# Altium schematic sheet Comunicaciones.SchDoc
size A4
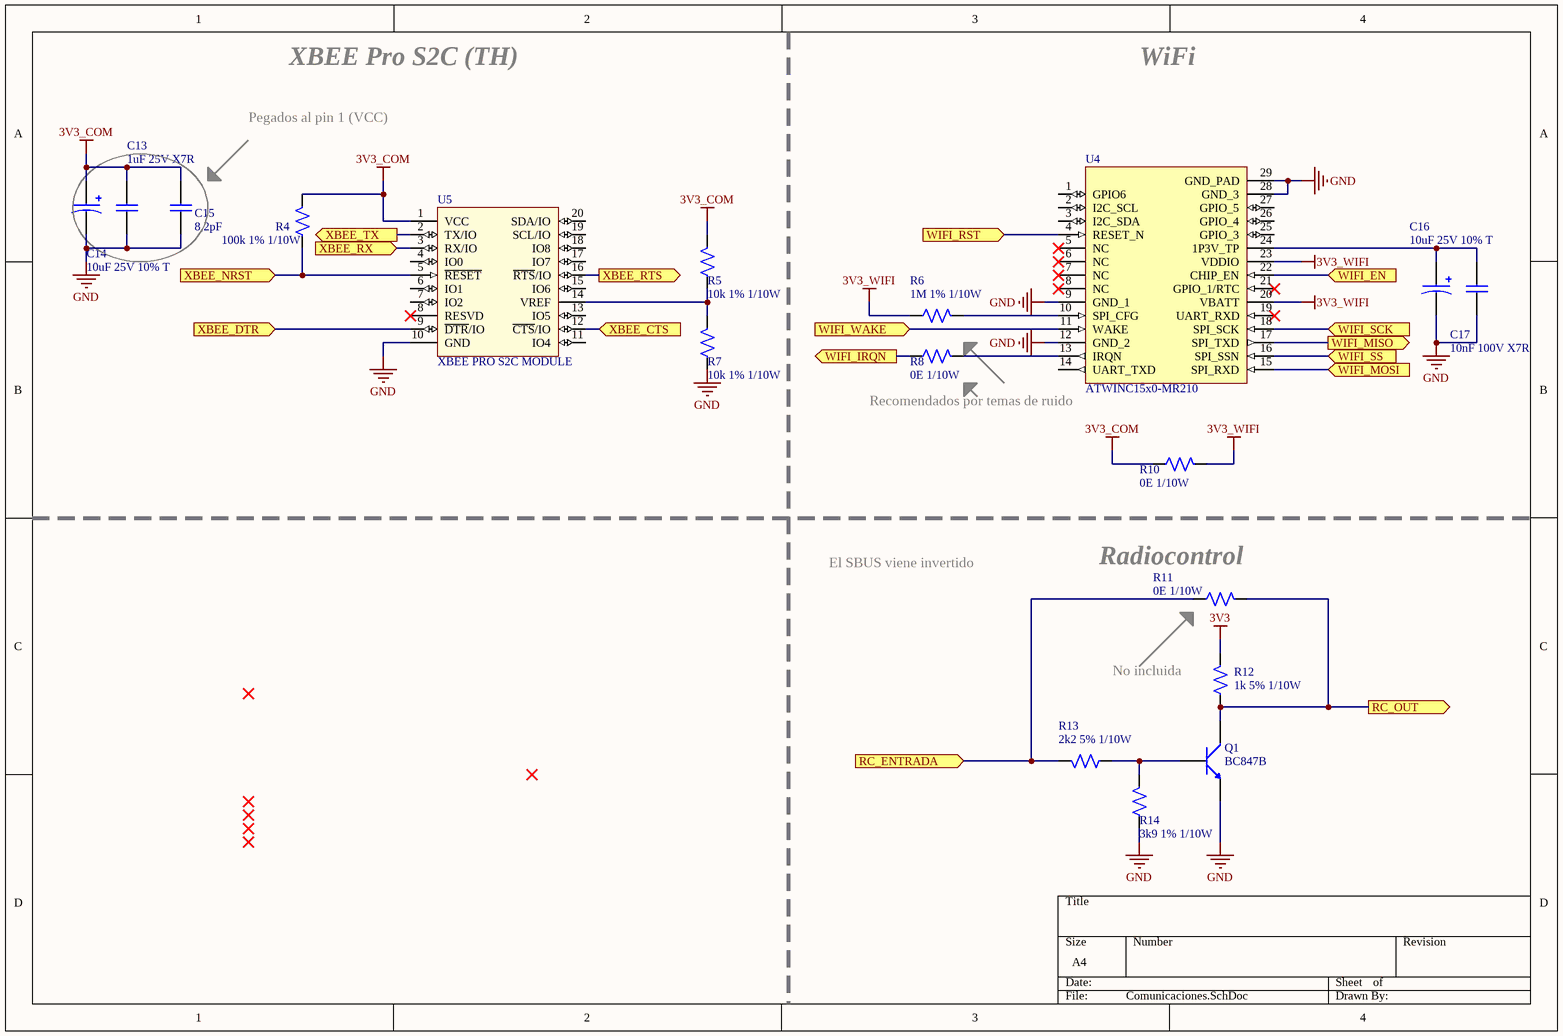
[diagram p0: Comunicaciones.SchDoc]

## Parts
C13  1uF 25V X7R  [C0603]
C14  10uF 25V 10% T  [AVX_C]
C15  Valor: 8,2pF  [C0603]  (hidden comment: 8,2pF 50V COG 5%)
C16  10uF 25V 10% T  [AVX_C]
C17  10nF 100V X7R  [C0603]
Q1  BC847B  [SOT23]
R4  100k 1% 1/10W  [R0603]
R5  10k 1% 1/10W  [R0603]
R6  1M 1% 1/10W  [R0603]
R7  10k 1% 1/10W  [R0603]
R8  0E 1/10W  [R0603]
R10  0E 1/10W  [R0805]
R11  0E 1/10W  [R0603]
R12  1k 5% 1/10W  [R0603]
R13  2k2 5% 1/10W  [R0603]
R14  3k9 1% 1/10W  [R0603]
U4  ATWINC15x0-MR210  [ATWINC15x0-MR210PB]
U5  XBEE PRO S2C MODULE  [XbeePRO]

## Ports
RC_ENTRADA (in), RC_OUT (out), WIFI_EN (in), WIFI_IRQN (out), WIFI_MISO (out), WIFI_MOSI (in), WIFI_RST (in), WIFI_SCK (in), WIFI_SS (in), WIFI_WAKE (in), XBEE_CTS (in), XBEE_DTR (in), XBEE_NRST (in), XBEE_RTS (out), XBEE_RX (in), XBEE_TX (out)

## Nets
3V3: R12.2
3V3_COM: C13.1 C14.1 C15.1 R4.2 R5.2 R10.1 U5.1(VCC)
3V3_WIFI: R6.1 R10.2 U4.20(VBATT) U4.23(VDDIO)
GND: C13.2 C14.2 C15.2 C16.2 C17.2 Q1.3(E) R7.1 R14.1 U4.9(GND_1) U4.12(GND_2) U4.28(GND_3) U4.29(GND_PAD) U5.10(GND)
RC_ENTRADA: R11.1 R13.2 ; port RC_ENTRADA
RC_OUT: Q1.2(C) R11.2 R12.1 ; port RC_OUT
WIFI_EN: U4.22(CHIP_EN) ; port WIFI_EN
WIFI_IRQN: R8.1 ; port WIFI_IRQN
WIFI_MISO: U4.17(SPI_TXD) ; port WIFI_MISO
WIFI_MOSI: U4.15(SPI_RXD) ; port WIFI_MOSI
WIFI_RST: U4.4(RESET_N) ; port WIFI_RST
WIFI_SCK: U4.18(SPI_SCK) ; port WIFI_SCK
WIFI_SS: U4.16(SPI_SSN) ; port WIFI_SS
WIFI_WAKE: U4.11(WAKE) ; port WIFI_WAKE
XBEE_CTS: U5.12(~{CTS}/IO) ; port XBEE_CTS
XBEE_DTR: U5.9(~{DTR}/IO) ; port XBEE_DTR
XBEE_NRST: R4.1 U5.5(~{RESET}) ; port XBEE_NRST
XBEE_RTS: U5.16(~{RTS}/IO) ; port XBEE_RTS
XBEE_RX: U5.3(RX/IO) ; port XBEE_RX
XBEE_TX: U5.2(TX/IO) ; port XBEE_TX
NetC16_1: C16.1 C17.1 U4.24(1P3V_TP)
NetQ1_1: Q1.1(B) R13.1 R14.2
NetR5_1: R5.1 R7.2 U5.14(VREF)
NetR6_2: R6.2 U4.10(SPI_CFG)
NetR8_2: R8.2 U4.13(IRQN)

Not connected (* = marked no-connect by the designer): U4 1(GPIO6) 2(I2C_SCL) 3(I2C_SDA) 5(NC)* 6(NC)* 7(NC)* 8(NC)* 14(UART_TXD) 19(UART_RXD)* 21(GPIO_1/RTC)* 25(GPIO_3) 26(GPIO_4) 27(GPIO_5); U5 4(IO0) 6(IO1) 7(IO2) 8(RESVD)* 11(IO4) 13(IO5) 15(IO6) 17(IO7) 18(IO8) 19(SCL/IO) 20(SDA/IO)

## Notes on the sheet
- XBEE Pro S2C (TH)
- WiFi
- Pegados al pin 1 (VCC)
- Recomendados por temas de ruido
- El SBUS viene invertido
- (near R11) Radiocontrol
- (near R12) No incluida

## Library data of the parts
C13 = Capacitor: Capacitor de placas paralelas; Proveedor: Mouser; Cod. Proveedor: 810-C1608X7R1E105KAE; Encapsulado: C0603; Valor: 1uF; Link: https://ar.mouser.com
C14 C16 = CapaPol: Capacitor polarizado; Cod. Proveedor: 80-T491C106K25AT7280; Proveedor: Mouser; Encapsulado: AVX C Case; Valor: 10uF; Link: https://ar.mouser.com/
C15 = Capacitor: Capacitor de placas paralelas; Proveedor: Elemon; Cod. Proveedor: CA3278332; Encapsulado: C0603; Link: http://www.elemon.net/
C17 = Capacitor: Capacitor de placas paralelas; Proveedor: Mouser; Cod. Proveedor: 81-GCM188R72A103KA7D; Encapsulado: C0603; Valor: 10nF; Link: https://ar.mouser.com
Q1 = NPN: Transistor bipolar de juntura NPN; Proveedor: Elemon; Cod. Proveedor: TR1723043; Encapsulado: SOT23; Link: www.elemon.net
R4 = Resistor: Resistencia; Cod. Proveedor: 71-CRCW0603100KFKEAC; Proveedor: Mouser; Encapsulado: R0603; Valor: 100k; Link: https://ar.mouser.com
R5 R7 = Resistor: Resistencia; Cod. Proveedor: 71-CRCW060310K0FKEAC; Proveedor: Mouser; Encapsulado: R0603; Valor: 10k; Link: https://ar.mouser.com
R6 = Resistor: Resistencia; Cod. Proveedor: 603-RC0603FR-101ML; Proveedor: Mouser; Encapsulado: R0603; Valor: 1M; Link: https://ar.mouser.com
R8 R11 = Resistor: Resistencia; Cod. Proveedor: RS3895900; Proveedor: Mouser; Encapsulado: R0603; Valor: 0E; Link: https://ar.mouser.com
R10 = Resistor: Resistencia; Cod. Proveedor: RS3895900; Proveedor: Mouser; Encapsulado: MODIFICAR; Valor: 0E; Link: https://ar.mouser.com
R12 = Resistor: Resistencia; Cod. Proveedor: 603-AF0603JR-071KL; Proveedor: Mouser; Encapsulado: R0603; Valor: 1k; Link: https://ar.mouser.com
R13 = Resistor: Resistencia; Cod. Proveedor: 71-CRCW06032K20JNEAC; Proveedor: Mouser; Encapsulado: R0603; Valor: 2k2; Link: https://ar.mouser.com
R14 = Resistor: Resistencia; Cod. Proveedor: 71-CRCW06033K90FKEAC; Proveedor: Mouser; Encapsulado: R0603; Valor: 3k9; Link: https://ar.mouser.com
U4 = ATWINC15x0-MR210: IEEE 802.11 b/g/n SmartConnect  IoT Module; Proveedor: Mouser; Cod. Proveedor: 556-1500MR210PB1952; Encapsulado: ATWINC15x0-MR210PB; Link: https://ar.mouser.com/
U5 = XbeePRO_S2C: Conector modulo Zigbee Series 2 C; Proveedor: Mouser; Cod. Proveedor: 888-XBP24CAUIT-001; Encapsulado: Through Hole; Link: https://ar.mouser.com/